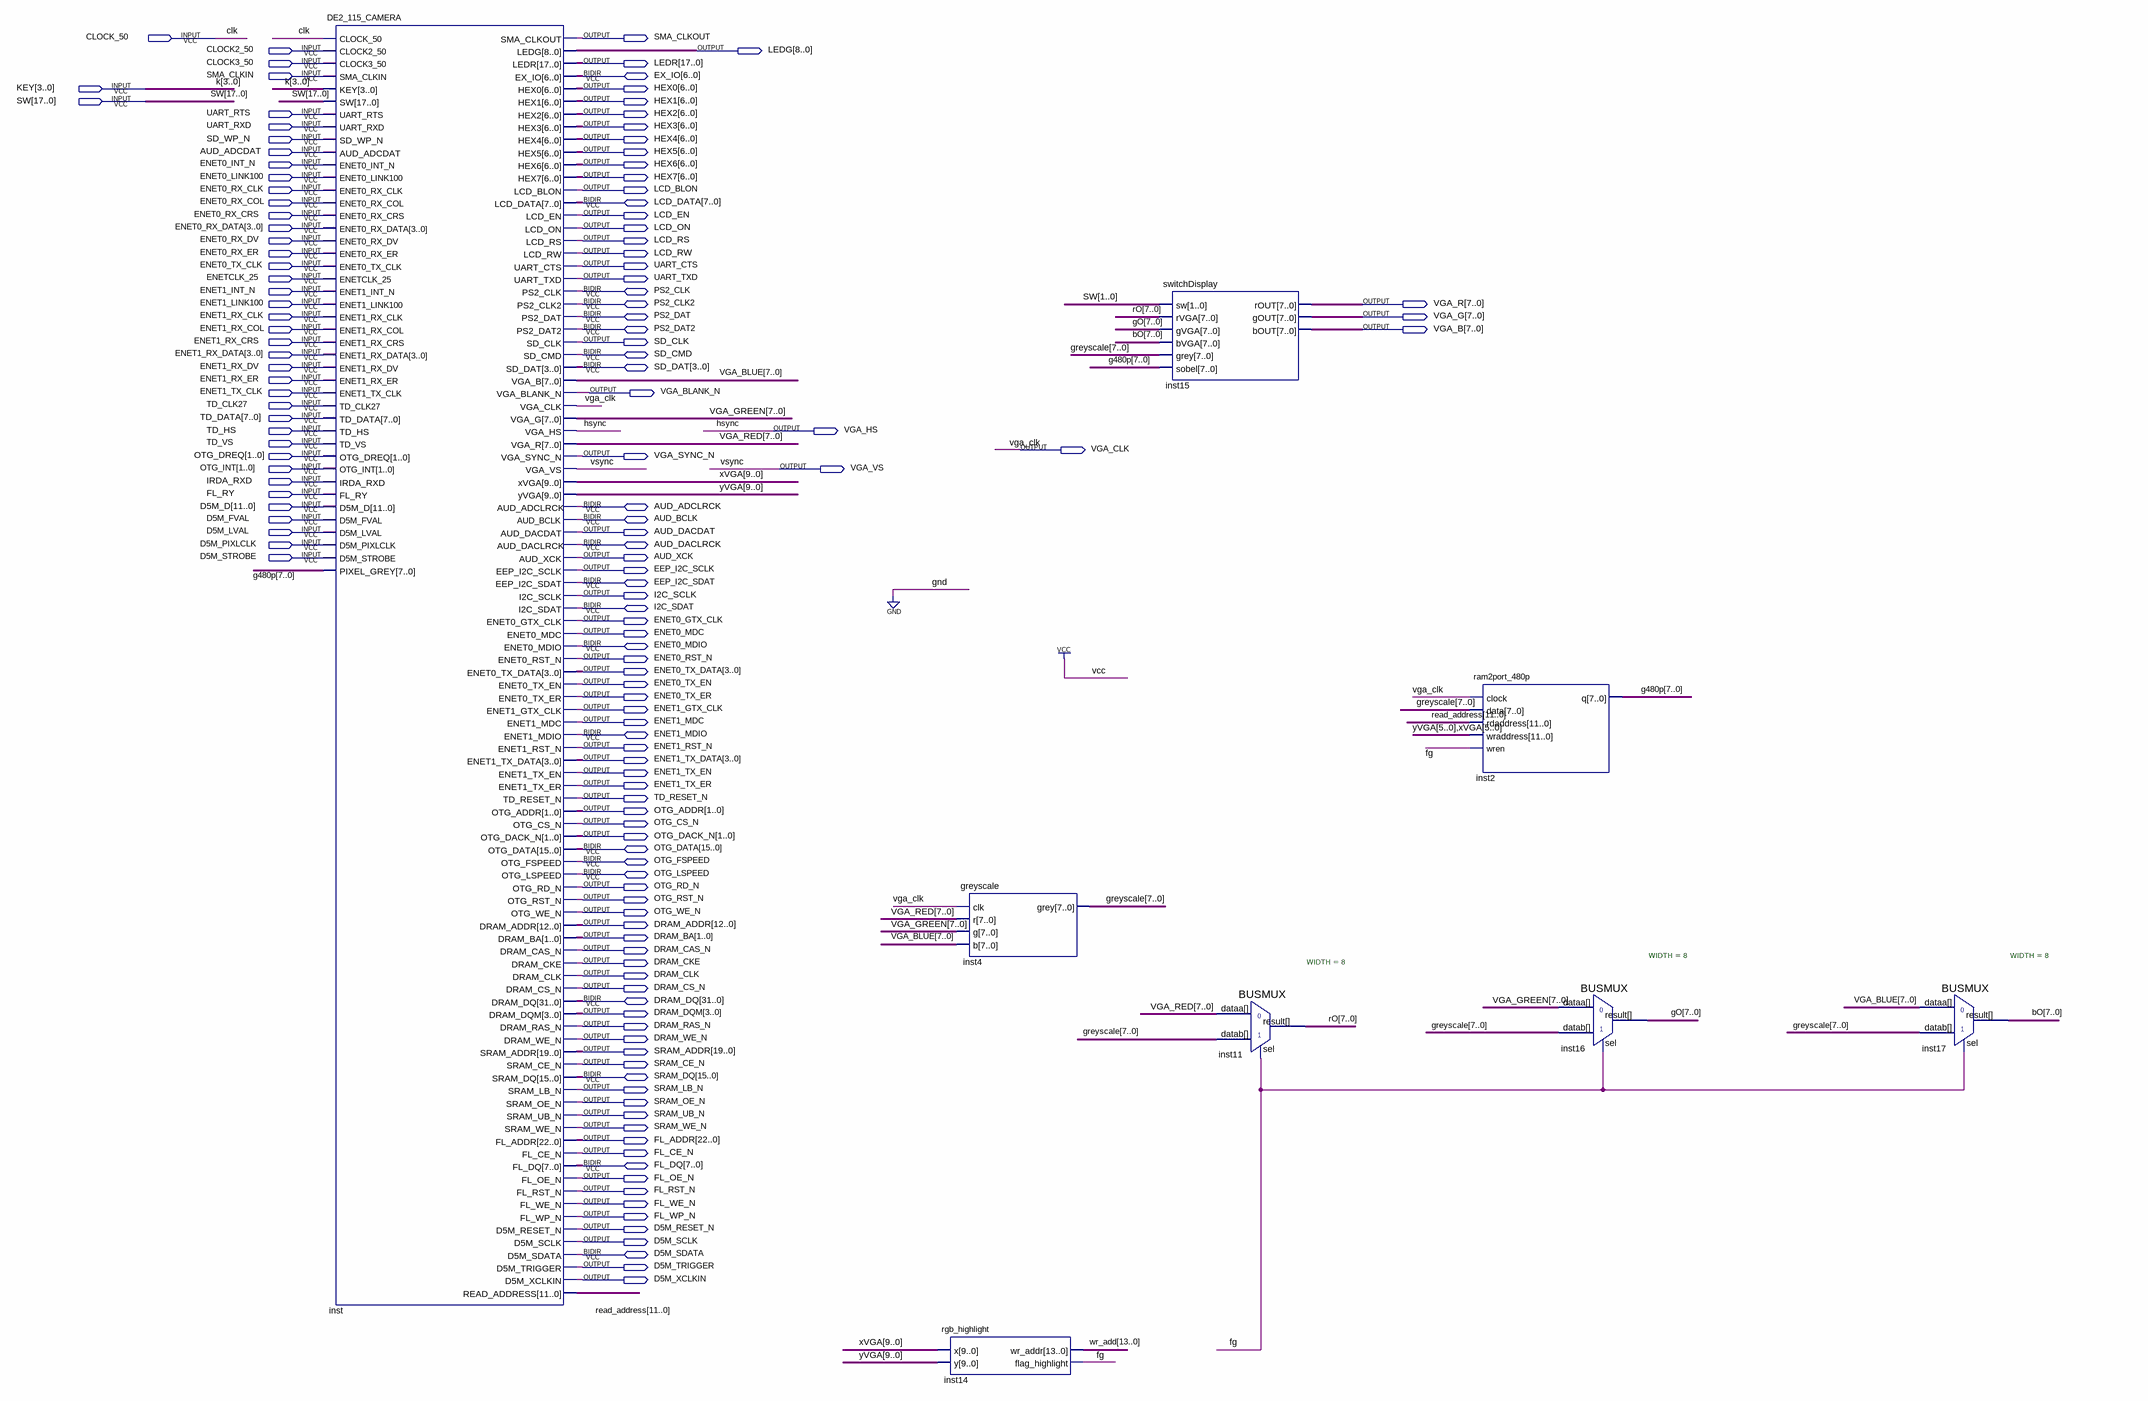
[diagram p0: schematic sheet]
// Quartus schematic DE2_115_CAMERA_BD.bdf as structural Verilog: 8 symbols, 139 pins
module DE2_115_CAMERA_BD (
  input  CLOCK_50,
  input  CLOCK2_50,
  input  CLOCK3_50,
  input  SMA_CLKIN,
  input  [3:0] KEY,
  input  [17:0] SW,
  input  UART_RTS,
  input  UART_RXD,
  input  SD_WP_N,
  input  AUD_ADCDAT,
  input  ENET0_INT_N,
  input  ENET0_LINK100,
  input  ENET0_RX_CLK,
  input  ENET0_RX_COL,
  input  ENET0_RX_CRS,
  input  [3:0] ENET0_RX_DATA,
  input  ENET0_RX_DV,
  input  ENET0_RX_ER,
  input  ENET0_TX_CLK,
  input  ENETCLK_25,
  input  ENET1_INT_N,
  input  ENET1_LINK100,
  input  ENET1_RX_CLK,
  input  ENET1_RX_COL,
  input  ENET1_RX_CRS,
  input  [3:0] ENET1_RX_DATA,
  input  ENET1_RX_DV,
  input  ENET1_RX_ER,
  input  ENET1_TX_CLK,
  input  TD_CLK27,
  input  [7:0] TD_DATA,
  input  TD_HS,
  input  TD_VS,
  input  [1:0] OTG_DREQ,
  input  [1:0] OTG_INT,
  input  IRDA_RXD,
  input  FL_RY,
  input  [11:0] D5M_D,
  input  D5M_FVAL,
  input  D5M_LVAL,
  input  D5M_PIXLCLK,
  input  D5M_STROBE,
  inout  [6:0] EX_IO,
  inout  [7:0] LCD_DATA,
  inout  PS2_CLK,
  inout  PS2_CLK2,
  inout  PS2_DAT,
  inout  PS2_DAT2,
  inout  SD_CMD,
  inout  [3:0] SD_DAT,
  inout  AUD_ADCLRCK,
  inout  AUD_BCLK,
  inout  AUD_DACLRCK,
  inout  EEP_I2C_SDAT,
  inout  I2C_SDAT,
  inout  ENET0_MDIO,
  inout  ENET1_MDIO,
  inout  [15:0] OTG_DATA,
  inout  OTG_FSPEED,
  inout  OTG_LSPEED,
  inout  [31:0] DRAM_DQ,
  inout  [15:0] SRAM_DQ,
  inout  [7:0] FL_DQ,
  inout  D5M_SDATA,
  output SMA_CLKOUT,
  output [8:0] LEDG,
  output [17:0] LEDR,
  output [6:0] HEX0,
  output [6:0] HEX1,
  output [6:0] HEX2,
  output [6:0] HEX3,
  output [6:0] HEX4,
  output [6:0] HEX5,
  output [6:0] HEX6,
  output [6:0] HEX7,
  output LCD_BLON,
  output LCD_EN,
  output LCD_ON,
  output LCD_RS,
  output LCD_RW,
  output UART_CTS,
  output UART_TXD,
  output [7:0] VGA_R,
  output [7:0] VGA_G,
  output [7:0] VGA_B,
  output SD_CLK,
  output VGA_BLANK_N,
  output VGA_HS,
  output VGA_CLK,
  output VGA_SYNC_N,
  output VGA_VS,
  output AUD_DACDAT,
  output AUD_XCK,
  output EEP_I2C_SCLK,
  output I2C_SCLK,
  output ENET0_GTX_CLK,
  output ENET0_MDC,
  output ENET0_RST_N,
  output [3:0] ENET0_TX_DATA,
  output ENET0_TX_EN,
  output ENET0_TX_ER,
  output ENET1_GTX_CLK,
  output ENET1_MDC,
  output ENET1_RST_N,
  output [3:0] ENET1_TX_DATA,
  output ENET1_TX_EN,
  output ENET1_TX_ER,
  output TD_RESET_N,
  output [1:0] OTG_ADDR,
  output OTG_CS_N,
  output [1:0] OTG_DACK_N,
  output OTG_RD_N,
  output OTG_RST_N,
  output OTG_WE_N,
  output [12:0] DRAM_ADDR,
  output [1:0] DRAM_BA,
  output DRAM_CAS_N,
  output DRAM_CKE,
  output DRAM_CLK,
  output DRAM_CS_N,
  output [3:0] DRAM_DQM,
  output DRAM_RAS_N,
  output DRAM_WE_N,
  output [19:0] SRAM_ADDR,
  output SRAM_CE_N,
  output SRAM_LB_N,
  output SRAM_OE_N,
  output SRAM_UB_N,
  output SRAM_WE_N,
  output [22:0] FL_ADDR,
  output FL_CE_N,
  output FL_OE_N,
  output FL_RST_N,
  output FL_WE_N,
  output FL_WP_N,
  output D5M_RESET_N,
  output D5M_SCLK,
  output D5M_TRIGGER,
  output D5M_XCLKIN
);

  wire fg;
  wire [7:0] bO, g480p, gO, greyscale, rO, VGA_BLUE, VGA_GREEN, VGA_RED;
  wire [9:0] xVGA, yVGA;
  wire [11:0] read_address;
  wire [13:0] wr_add;

  DE2_115_CAMERA inst (
    .CLOCK_50(CLOCK_50), .CLOCK2_50(CLOCK2_50), .CLOCK3_50(CLOCK3_50), .SMA_CLKIN(SMA_CLKIN), .KEY(KEY),
    .SW(SW), .UART_RTS(UART_RTS), .UART_RXD(UART_RXD), .SD_WP_N(SD_WP_N), .AUD_ADCDAT(AUD_ADCDAT),
    .ENET0_INT_N(ENET0_INT_N), .ENET0_LINK100(ENET0_LINK100), .ENET0_RX_CLK(ENET0_RX_CLK),
    .ENET0_RX_COL(ENET0_RX_COL), .ENET0_RX_CRS(ENET0_RX_CRS), .ENET0_RX_DATA(ENET0_RX_DATA),
    .ENET0_RX_DV(ENET0_RX_DV), .ENET0_RX_ER(ENET0_RX_ER), .ENET0_TX_CLK(ENET0_TX_CLK),
    .ENETCLK_25(ENETCLK_25), .ENET1_INT_N(ENET1_INT_N), .ENET1_LINK100(ENET1_LINK100),
    .ENET1_RX_CLK(ENET1_RX_CLK), .ENET1_RX_COL(ENET1_RX_COL), .ENET1_RX_CRS(ENET1_RX_CRS),
    .ENET1_RX_DATA(ENET1_RX_DATA), .ENET1_RX_DV(ENET1_RX_DV), .ENET1_RX_ER(ENET1_RX_ER),
    .ENET1_TX_CLK(ENET1_TX_CLK), .TD_CLK27(TD_CLK27), .TD_DATA(TD_DATA), .TD_HS(TD_HS), .TD_VS(TD_VS),
    .OTG_DREQ(OTG_DREQ), .OTG_INT(OTG_INT), .IRDA_RXD(IRDA_RXD), .FL_RY(FL_RY), .D5M_D(D5M_D),
    .D5M_FVAL(D5M_FVAL), .D5M_LVAL(D5M_LVAL), .D5M_PIXLCLK(D5M_PIXLCLK), .D5M_STROBE(D5M_STROBE),
    .PIXEL_GREY(g480p), .SMA_CLKOUT(SMA_CLKOUT), .LEDG(LEDG), .LEDR(LEDR), .HEX0(HEX0), .HEX1(HEX1),
    .HEX2(HEX2), .HEX3(HEX3), .HEX4(HEX4), .HEX5(HEX5), .HEX6(HEX6), .HEX7(HEX7), .LCD_BLON(LCD_BLON),
    .LCD_EN(LCD_EN), .LCD_ON(LCD_ON), .LCD_RS(LCD_RS), .LCD_RW(LCD_RW), .UART_CTS(UART_CTS),
    .UART_TXD(UART_TXD), .SD_CLK(SD_CLK), .VGA_B(VGA_BLUE), .VGA_BLANK_N(VGA_BLANK_N), .VGA_CLK(VGA_CLK),
    .VGA_G(VGA_GREEN), .VGA_HS(VGA_HS), .VGA_R(VGA_RED), .VGA_SYNC_N(VGA_SYNC_N), .VGA_VS(VGA_VS),
    .xVGA(xVGA), .yVGA(yVGA), .AUD_DACDAT(AUD_DACDAT), .AUD_XCK(AUD_XCK), .EEP_I2C_SCLK(EEP_I2C_SCLK),
    .I2C_SCLK(I2C_SCLK), .ENET0_GTX_CLK(ENET0_GTX_CLK), .ENET0_MDC(ENET0_MDC), .ENET0_RST_N(ENET0_RST_N),
    .ENET0_TX_DATA(ENET0_TX_DATA), .ENET0_TX_EN(ENET0_TX_EN), .ENET0_TX_ER(ENET0_TX_ER),
    .ENET1_GTX_CLK(ENET1_GTX_CLK), .ENET1_MDC(ENET1_MDC), .ENET1_RST_N(ENET1_RST_N),
    .ENET1_TX_DATA(ENET1_TX_DATA), .ENET1_TX_EN(ENET1_TX_EN), .ENET1_TX_ER(ENET1_TX_ER),
    .TD_RESET_N(TD_RESET_N), .OTG_ADDR(OTG_ADDR), .OTG_CS_N(OTG_CS_N), .OTG_DACK_N(OTG_DACK_N),
    .OTG_RD_N(OTG_RD_N), .OTG_RST_N(OTG_RST_N), .OTG_WE_N(OTG_WE_N), .DRAM_ADDR(DRAM_ADDR),
    .DRAM_BA(DRAM_BA), .DRAM_CAS_N(DRAM_CAS_N), .DRAM_CKE(DRAM_CKE), .DRAM_CLK(DRAM_CLK),
    .DRAM_CS_N(DRAM_CS_N), .DRAM_DQM(DRAM_DQM), .DRAM_RAS_N(DRAM_RAS_N), .DRAM_WE_N(DRAM_WE_N),
    .SRAM_ADDR(SRAM_ADDR), .SRAM_CE_N(SRAM_CE_N), .SRAM_LB_N(SRAM_LB_N), .SRAM_OE_N(SRAM_OE_N),
    .SRAM_UB_N(SRAM_UB_N), .SRAM_WE_N(SRAM_WE_N), .FL_ADDR(FL_ADDR), .FL_CE_N(FL_CE_N), .FL_OE_N(FL_OE_N),
    .FL_RST_N(FL_RST_N), .FL_WE_N(FL_WE_N), .FL_WP_N(FL_WP_N), .D5M_RESET_N(D5M_RESET_N),
    .D5M_SCLK(D5M_SCLK), .D5M_TRIGGER(D5M_TRIGGER), .D5M_XCLKIN(D5M_XCLKIN), .READ_ADDRESS(read_address),
    .EX_IO(EX_IO), .LCD_DATA(LCD_DATA), .PS2_CLK(PS2_CLK), .PS2_CLK2(PS2_CLK2), .PS2_DAT(PS2_DAT),
    .PS2_DAT2(PS2_DAT2), .SD_CMD(SD_CMD), .SD_DAT(SD_DAT), .AUD_ADCLRCK(AUD_ADCLRCK), .AUD_BCLK(AUD_BCLK),
    .AUD_DACLRCK(AUD_DACLRCK), .EEP_I2C_SDAT(EEP_I2C_SDAT), .I2C_SDAT(I2C_SDAT), .ENET0_MDIO(ENET0_MDIO),
    .ENET1_MDIO(ENET1_MDIO), .OTG_DATA(OTG_DATA), .OTG_FSPEED(OTG_FSPEED), .OTG_LSPEED(OTG_LSPEED),
    .DRAM_DQ(DRAM_DQ), .SRAM_DQ(SRAM_DQ), .FL_DQ(FL_DQ), .D5M_SDATA(D5M_SDATA));
  greyscale inst4 (.clk(VGA_CLK), .r(VGA_RED), .g(VGA_GREEN), .b(VGA_BLUE), .grey(greyscale));
  rgb_highlight inst14 (.x(xVGA), .y(yVGA), .wr_addr(wr_add), .flag_highlight(fg));
  switchDisplay inst15 (
    .sw(SW[1:0]), .rVGA(rO), .gVGA(gO), .bVGA(bO), .grey(greyscale), .sobel(g480p), .rOUT(VGA_R),
    .gOUT(VGA_G), .bOUT(VGA_B));
  BUSMUX #(.WIDTH(8)) inst11 (.datab(greyscale), .sel(fg), .dataa(VGA_RED), .result(rO));
  ram2port_480p inst2 (
    .clock(VGA_CLK), .data(greyscale), .rdaddress(read_address), .wraddress({yVGA[5:0], xVGA[5:0]}),
    .wren(fg), .q(g480p));
  BUSMUX #(.WIDTH(8)) inst16 (.datab(greyscale), .sel(fg), .dataa(VGA_GREEN), .result(gO));
  BUSMUX #(.WIDTH(8)) inst17 (.datab(greyscale), .sel(fg), .dataa(VGA_BLUE), .result(bO));

  // Other names for the same wires on the sheet: clk = CLOCK_50; hsync = VGA_HS; k[3:0] = KEY; vsync = VGA_VS
endmodule
